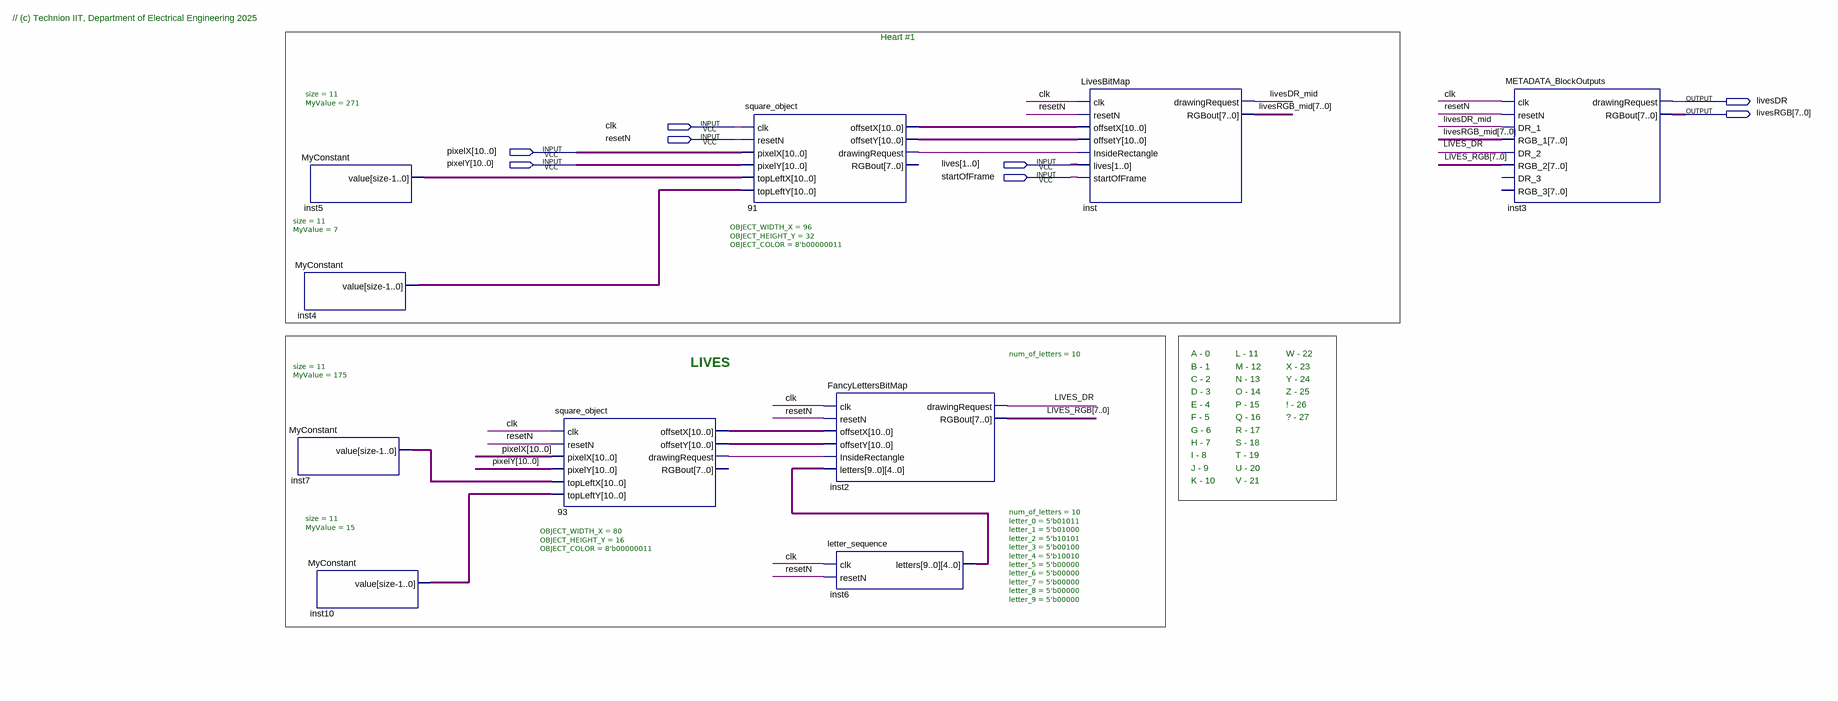
[diagram p0: schematic sheet]
// Quartus schematic Lives_Block.bdf as structural Verilog: 10 symbols, 8 pins
module Lives_Block (
  input  clk,
  input  resetN,
  input  [10:0] pixelX,
  input  [10:0] pixelY,
  input  [1:0] lives,
  input  startOfFrame,
  output livesDR,
  output [7:0] livesRGB
);

  wire LIVES_DR, livesDR_mid, n91_drawingrequest, n93_drawingrequest;
  wire [7:0] LIVES_RGB, livesRGB_mid;
  wire [10:0] inst4_value, inst5_value, inst7_value, inst10_value, n91_offsetx, n91_offsety, n93_offsetx,
       n93_offsety;
  wire [49:0] inst6_letters;

  MyConstant #(.size(11), .MyValue(271)) inst5 (.value(inst5_value));
  MyConstant #(.size(11), .MyValue(7)) inst4 (.value(inst4_value));
  MyConstant #(.size(11), .MyValue(175)) inst7 (.value(inst7_value));
  MyConstant #(.size(11), .MyValue(15)) inst10 (.value(inst10_value));
  square_object #(.OBJECT_WIDTH_X(80), .OBJECT_HEIGHT_Y(16), .OBJECT_COLOR(8'b00000011)) u_93 (
    .clk(clk), .resetN(resetN), .pixelX(pixelX), .pixelY(pixelY), .topLeftX(inst7_value),
    .topLeftY(inst10_value), .offsetX(n93_offsetx), .offsetY(n93_offsety), .drawingRequest(n93_drawingrequest));  // open: RGBout
  square_object #(.OBJECT_WIDTH_X(96), .OBJECT_HEIGHT_Y(32), .OBJECT_COLOR(8'b00000011)) u_91 (
    .clk(clk), .resetN(resetN), .pixelX(pixelX), .pixelY(pixelY), .topLeftX(inst5_value),
    .topLeftY(inst4_value), .offsetX(n91_offsetx), .offsetY(n91_offsety), .drawingRequest(n91_drawingrequest));  // open: RGBout
  FancyLettersBitMap #(.num_of_letters(10)) inst2 (
    .clk(clk), .resetN(resetN), .offsetX(n93_offsetx), .offsetY(n93_offsety),
    .InsideRectangle(n93_drawingrequest), .letters(inst6_letters), .drawingRequest(LIVES_DR),
    .RGBout(LIVES_RGB));
  letter_sequence #(.num_of_letters(10), .letter_0(5'b01011), .letter_1(5'b01000), .letter_2(5'b10101), .letter_3(5'b00100), .letter_4(5'b10010), .letter_5(5'b00000), .letter_6(5'b00000), .letter_7(5'b00000), .letter_8(5'b00000), .letter_9(5'b00000)) inst6 (
    .clk(clk), .resetN(resetN), .letters(inst6_letters));
  LivesBitMap inst (
    .clk(clk), .resetN(resetN), .offsetX(n91_offsetx), .offsetY(n91_offsety),
    .InsideRectangle(n91_drawingrequest), .lives(lives), .startOfFrame(startOfFrame),
    .drawingRequest(livesDR_mid), .RGBout(livesRGB_mid));
  METADATA_BlockOutputs inst3 (
    .clk(clk), .resetN(resetN), .DR_1(livesDR_mid), .RGB_1(livesRGB_mid), .DR_2(LIVES_DR), .RGB_2(LIVES_RGB),
    .drawingRequest(livesDR), .RGBout(livesRGB));  // open: DR_3, RGB_3

  // Notes on the sheet:
  //   // (c) Technion IIT, Department of Electrical Engineering 2025
  //   Heart #1
  //   A - 0
  //   L - 11
  //   W - 22
  //   LIVES
  //   B - 1
  //   M - 12
  //   X - 23
  //   C - 2
  //   N - 13
  //   Y - 24
  //   D - 3
  //   O - 14
  //   Z - 25
  //   E - 4
  //   P - 15
  //   ! - 26
  //   F - 5
  //   Q - 16
  //   ? - 27
  //   G - 6
  //   R - 17
  //   H - 7
  //   S - 18
  //   I - 8
  //   T - 19
  //   J - 9
  //   U - 20
  //   K - 10
  //   V - 21
endmodule
